# EAGLE design Tastatur_102 EAGLE 630 (EAGLE 6.3)

## Sheet 1 of 2
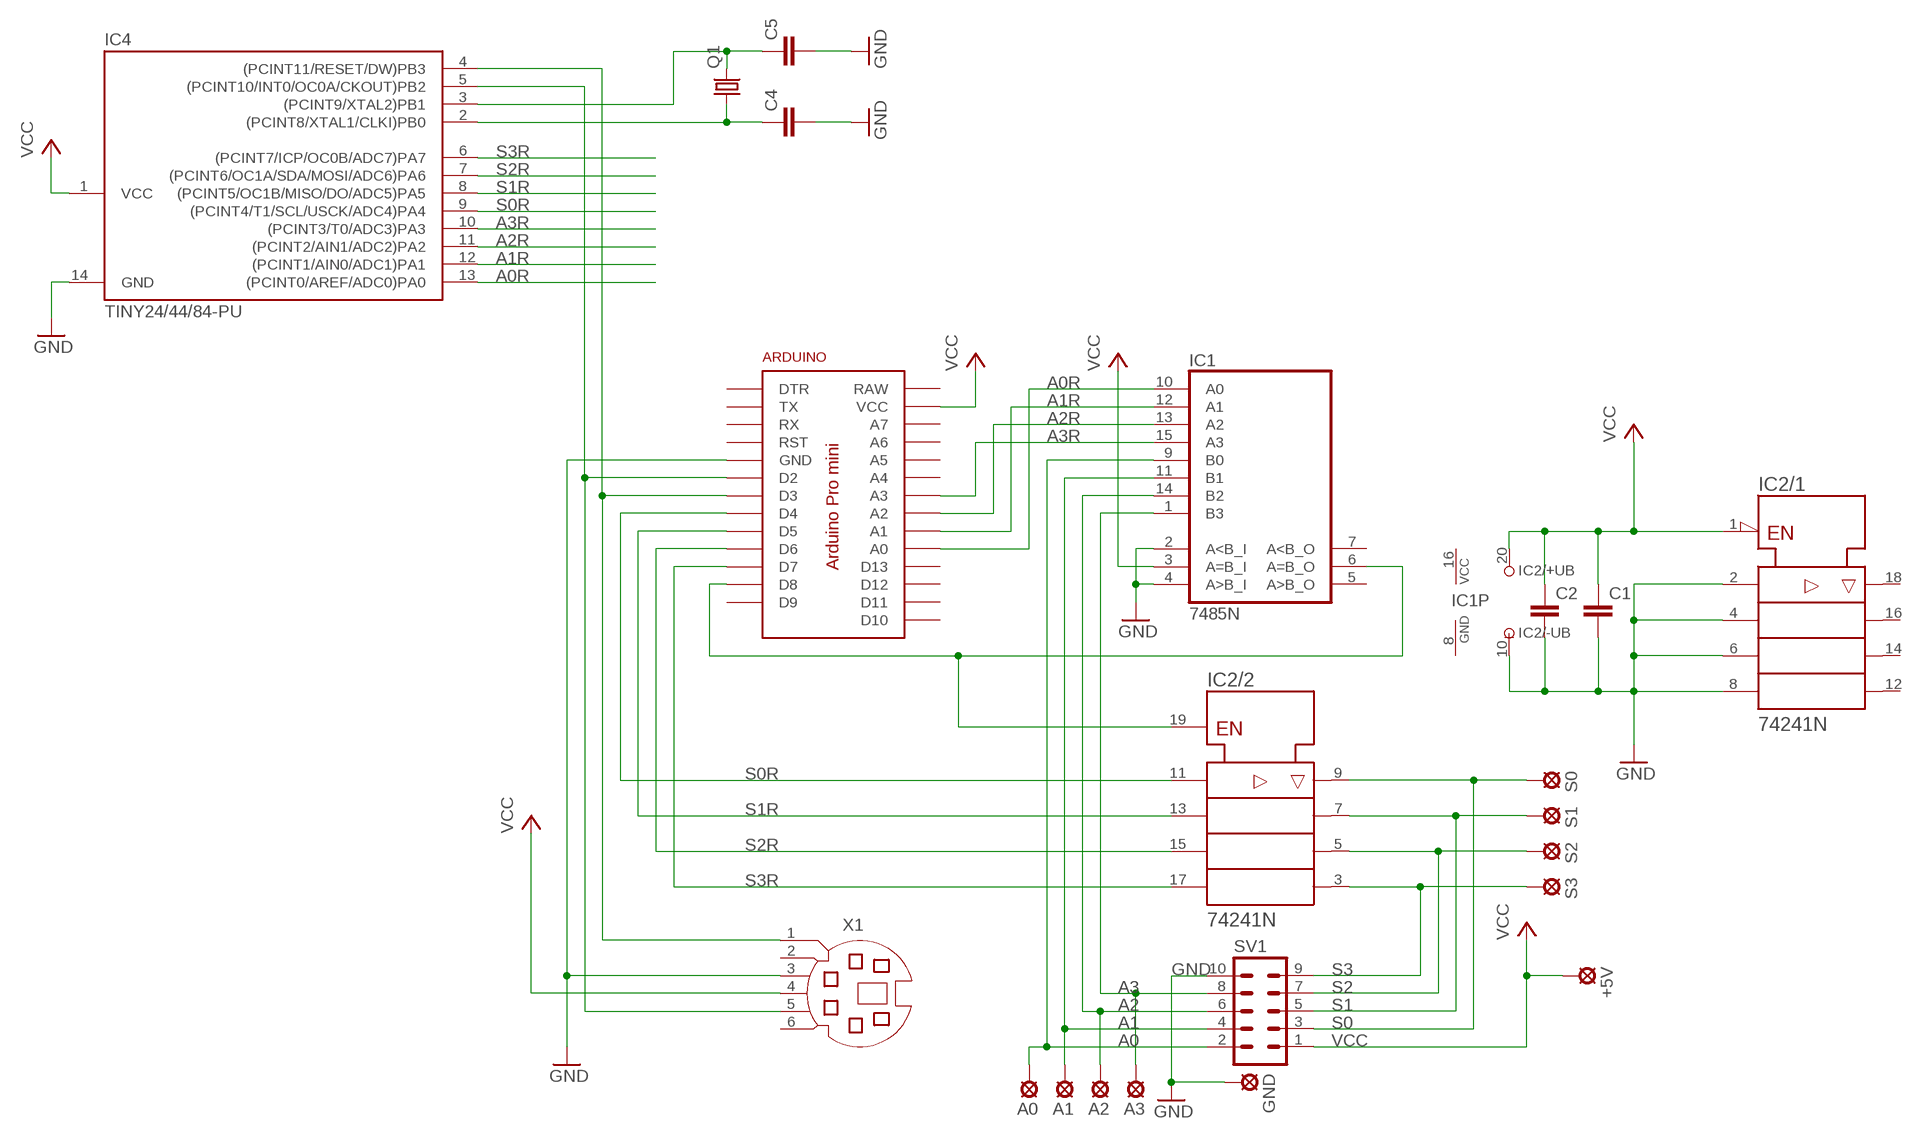
[diagram p0: schematic, sheet 1]

### Parts
+5V  MCS10B  [MCS10B]
A0  MCS10B  [MCS10B]
A1  MCS10B  [MCS10B]
A2  MCS10B  [MCS10B]
A3  MCS10B  [MCS10B]
ARDUINO  ARDUINO_PRO_MINIARDUINO_PRO_MINI_8  [ARDUINO_PRO_MINI_8]
C1  C-EU025-024X044  [C025-024X044]
C2  C-EU025-024X044  [C025-024X044]
C4  C-EU025-024X044  [C025-024X044]
C5  C-EU025-024X044  [C025-024X044]
GND  MCS10B  [MCS10B]
IC1  7485N  [DIL16]
IC2  74241N  [DIL20]
IC4  TINY24/44/84-PU  [DIL14]
Q1  CRYSTALHC49U-V  [HC49U-V]
S0  MCS10B  [MCS10B]
S1  MCS10B  [MCS10B]
S2  MCS10B  [MCS10B]
S3  MCS10B  [MCS10B]
SV1  ML10  [ML10]
X1  MD06SSMDIN06L  [MDIN06SSL]

### Nets
A0: A0.MP IC1.9(B0) SV1.2 ; also sheet 2
A0R: ARDUINO.A0 IC1.10(A0) IC4.13((PCINT0/AREF/ADC0)PA0)
A1: A1.MP IC1.11(B1) SV1.4 ; also sheet 2
A1R: ARDUINO.A1 IC1.12(A1) IC4.12((PCINT1/AIN0/ADC1)PA1)
A2: A2.MP IC1.14(B2) SV1.6 ; also sheet 2
A2R: ARDUINO.A2 IC1.13(A2) IC4.11((PCINT2/AIN1/ADC2)PA2)
A3: A3.MP IC1.1(B3) SV1.8 ; also sheet 2
A3R: ARDUINO.A3 IC1.15(A3) IC4.10((PCINT3/T0/ADC3)PA3)
GND: ARDUINO.GND ARDUINO.GND@1(GND) C1.2 C2.2 C4.2 C5.2 GND.MP IC1.2(A<B_I) IC1.4(A>B_I) IC2.2(/1:A1) IC2.4(/1:A2) IC2.6(/1:A3) IC2.8(/1:A4) IC2.10(/-UB:-UB) IC4.14(GND) SV1.10 X1.3 ; also sheet 2
N$1: ARDUINO.D2 IC4.5((PCINT10/INT0/OC0A/CKOUT)PB2) X1.5
N$2: ARDUINO.D3 IC4.4((PCINT11/RESET/DW)PB3) X1.1
N$3: C4.1 IC4.2((PCINT8/XTAL1/CLKI)PB0) Q1.1
N$4: C5.1 IC4.3((PCINT9/XTAL2)PB1) Q1.2
N$26: ARDUINO.D8 IC1.6(A=B_O) IC2.19(/2:G)
S0: IC2.9(/2:Y1) S0.MP SV1.3 ; also sheet 2
S0R: ARDUINO.D4 IC2.11(/2:A1) IC4.9((PCINT4/T1/SCL/USCK/ADC4)PA4)
S1: IC2.7(/2:Y2) S1.MP SV1.5 ; also sheet 2
S1R: ARDUINO.D5 IC2.13(/2:A2) IC4.8((PCINT5/OC1B/MISO/DO/ADC5)PA5)
S2: IC2.5(/2:Y3) S2.MP SV1.7 ; also sheet 2
S2R: ARDUINO.D6 IC2.15(/2:A3) IC4.7((PCINT6/OC1A/SDA/MOSI/ADC6)PA6)
S3: IC2.3(/2:Y4) S3.MP SV1.9 ; also sheet 2
S3R: ARDUINO.D7 IC2.17(/2:A4) IC4.6((PCINT7/ICP/OC0B/ADC7)PA7)
VCC: +5V.MP ARDUINO.VCC C1.1 C2.1 IC1.3(A=B_I) IC2.1(/1:!G) IC2.20(/+UB:+UB) IC4.1(VCC) SV1.1 X1.4 ; also sheet 2
Unconnected: ARDUINO.A4 ARDUINO.A5 ARDUINO.A6 ARDUINO.A7 ARDUINO.D9 ARDUINO.D10 ARDUINO.D11 ARDUINO.D12 ARDUINO.D13 ARDUINO.DTR ARDUINO.RAW ARDUINO.RST ARDUINO.RST@1(RST) ARDUINO.RX ARDUINO.TX IC1.5(A>B_O) IC1.7(A<B_O) IC2.12(/1:Y4) IC2.14(/1:Y3) IC2.16(/1:Y2) IC2.18(/1:Y1) X1.2 X1.6

## Sheet 2 of 2
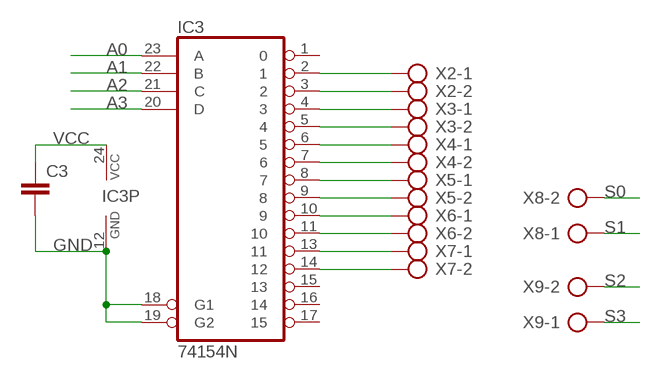
[diagram p1: schematic, sheet 2]

### Parts
C3  C-EU025-024X044  [C025-024X044]
IC3  74154N  [DIL24-6]
X2  AK500/2  [AK500/2]
X3  AK500/2  [AK500/2]
X4  AK500/2  [AK500/2]
X5  AK500/2  [AK500/2]
X6  AK500/2  [AK500/2]
X7  AK500/2  [AK500/2]
X8  AK500/2  [AK500/2]
X9  AK500/2  [AK500/2]

### Nets
A0: IC3.23(A) ; also sheet 1
A1: IC3.22(B) ; also sheet 1
A2: IC3.21(C) ; also sheet 1
A3: IC3.20(D) ; also sheet 1
GND: C3.2 IC3.12(GND) IC3.18(G1) IC3.19(G2) ; also sheet 1
N$6: IC3.2 X2.1
N$11: IC3.3 X2.2
N$13: IC3.4 X3.1
N$15: IC3.5 X3.2
N$17: IC3.6 X4.1
N$27: IC3.7 X4.2
N$30: IC3.8 X5.1
N$35: IC3.9 X5.2
N$37: IC3.10 X6.1
N$38: IC3.11 X6.2
N$39: IC3.13 X7.1
N$40: IC3.14 X7.2
S0: X8.2 ; also sheet 1
S1: X8.1 ; also sheet 1
S2: X9.2 ; also sheet 1
S3: X9.1 ; also sheet 1
VCC: C3.1 IC3.24(VCC) ; also sheet 1
Unconnected: IC3.1 IC3.15 IC3.16 IC3.17

## Power pins joined to a net without a drawn wire
GND: IC1.8(GND)
VCC: IC1.16(VCC)

## Library data of the parts
+5V A0 A1-A3 GND S0 S1-S3 = solpad:MCS10B: SOLDER PAD MC S1, distributor Buerklin, 15F505
ARDUINO = arduinopromini:ARDUINO_PRO_MINI: For creating Arduino Pro Mini shields
C1-C5 = rcl:C-EU: CAPACITOR, European symbol
IC1 = 74xx-eu:74*85: 4-bit magnitude COMPARATOR
IC2 = 74ttl-din:74*241: Octal BUFFER and LINE DRIVER, 3-state
IC3 = 74xx-eu:74*154: 4-line to 16-line data SELECTOR/MULTIPLEXER
IC4 = avr-6:TINY24/44/84
Q1 = adafruit:CRYSTAL: CRYSTAL; OC_FARNELL: 1666969; OC_NEWARK: unknown
SV1 = con-ml:ML10: HARTING; OC_FARNELL: unknown; OC_NEWARK: unknown
X1 = con-yamaichi:MD06SS: YAMAICHI CONNECTOR
X2-X9 = con-ptr500:AK500/2: CONNECTOR; OC_FARNELL: unknown; OC_NEWARK: unknown

## Board
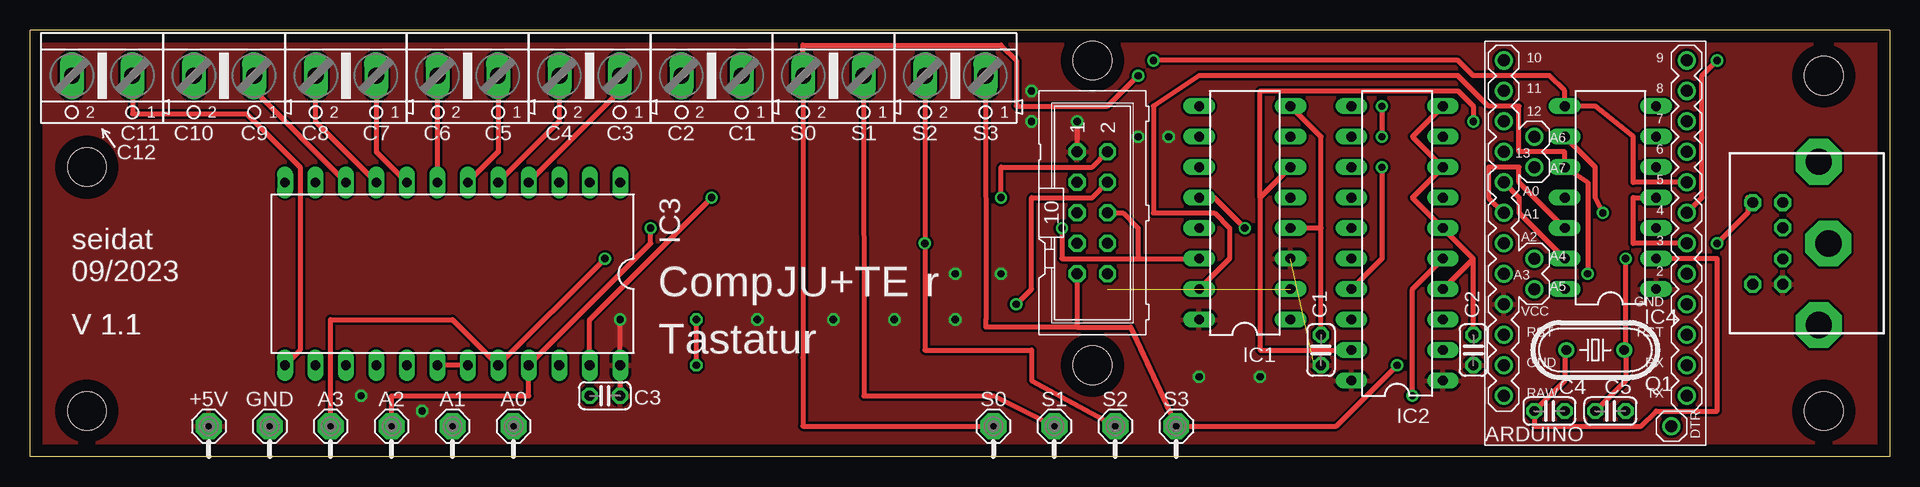
[diagram p2: board, top side]
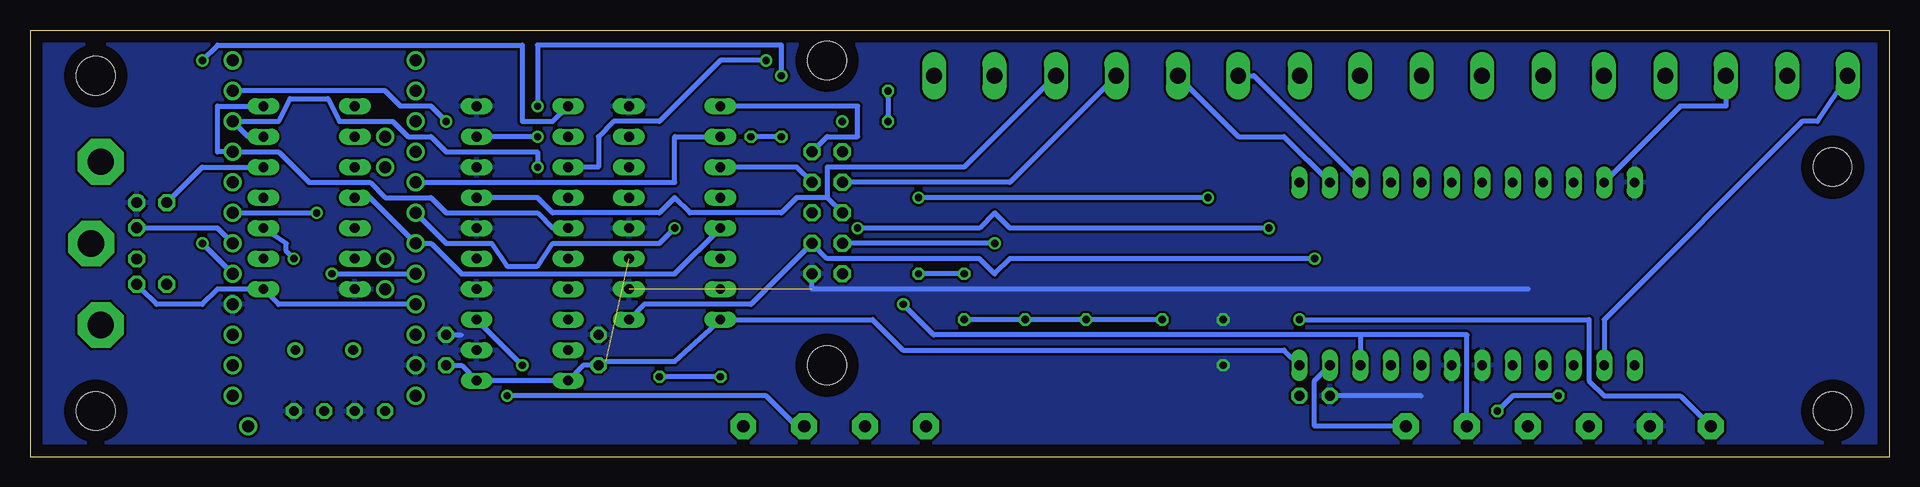
[diagram p3: board, bottom side, seen from below]

Size 155 x 35.56 mm. Coordinates in mm from the lower left corner, seen from the top.
Outline: 155,35.56 0,35.56 0,0 155,0 155,35.56
Copper layers (1*16): Top 0.035mm / dielectric 1.5mm / Bottom 0.035mm
Design rules "default *": minimum track width 16mil, minimum drill 24mil, track to track 8mil, track to pad 8mil, pad to pad 8mil, via to via 8mil, smd to smd 8mil, copper to edge 40mil, drill to drill 8mil, minimum pad ring 10mil, minimum via ring 8mil, stop-mask expansion 4mil, vias tented up to drill 0mil, thermal gap 10mil
Holes 3.2 mm at 149.52,3.81 149.52,31.75 88.56,7.62 88.56,33.02 4.74,24.13 4.74,3.81

### Footprints (pad centres in the part's own frame; a part is rotated, then mirrored left to right if it is on the bottom)
MCS10B = drill 1.016 pad 2.159 octagon: MP 0,0
ARDUINO_PRO_MINI_8 = drill 1: A0 7.62,-7.62; A1 7.62,-5.08; A2 7.62,-2.54; A3 7.62,0; A4 5.08,-1.27; A5 5.08,1.27; A6 5.08,-11.43; A7 5.08,-8.89; D2 -7.62,0; D3 -7.62,-2.54; D4 -7.62,-5.08; D5 -7.62,-7.62; D6 -7.62,-10.16; D7 -7.62,-12.7; D8 -7.62,-15.24; D9 -7.62,-17.78; D10 7.62,-17.78; D11 7.62,-15.24; D12 7.62,-12.7; D13 7.62,-10.16; DTR -6.35,12.7; GND -7.62,2.54; GND@1 7.62,7.62; RAW 7.62,10.16; RST 7.62,5.08; RST@1 -7.62,5.08; RX -7.62,7.62; TX -7.62,10.16; VCC 7.62,2.54
C025-024X044 = drill 0.813 octagon: 1 -1.27,0; 2 1.27,0
DIL16 = drill 0.813 long: 1 -8.89,-3.81; 2 -6.35,-3.81; 3 -3.81,-3.81; 4 -1.27,-3.81; 5 1.27,-3.81; 6 3.81,-3.81; 7 6.35,-3.81; 8 8.89,-3.81; 9 8.89,3.81; 10 6.35,3.81; 11 3.81,3.81; 12 1.27,3.81; 13 -1.27,3.81; 14 -3.81,3.81; 15 -6.35,3.81; 16 -8.89,3.81
DIL20 = drill 0.813 long: 1 -11.43,-3.81; 2 -8.89,-3.81; 3 -6.35,-3.81; 4 -3.81,-3.81; 5 -1.27,-3.81; 6 1.27,-3.81; 7 3.81,-3.81; 8 6.35,-3.81; 9 8.89,-3.81; 10 11.43,-3.81; 11 11.43,3.81; 12 8.89,3.81; 13 6.35,3.81; 14 3.81,3.81; 15 1.27,3.81; 16 -1.27,3.81; 17 -3.81,3.81; 18 -6.35,3.81; 19 -8.89,3.81; 20 -11.43,3.81
DIL24-6 = drill 0.813 long: 1 -13.97,-7.62; 2 -11.43,-7.62; 3 -8.89,-7.62; 4 -6.35,-7.62; 5 -3.81,-7.62; 6 -1.27,-7.62; 7 1.27,-7.62; 8 3.81,-7.62; 9 6.35,-7.62; 10 8.89,-7.62; 11 11.43,-7.62; 12 13.97,-7.62; 13 13.97,7.62; 14 11.43,7.62; 15 8.89,7.62; 16 6.35,7.62; 17 3.81,7.62; 18 1.27,7.62; 19 -1.27,7.62; 20 -3.81,7.62; 21 -6.35,7.62; 22 -8.89,7.62; 23 -11.43,7.62; 24 -13.97,7.62
DIL14 = drill 0.813 long: 1 -7.62,-3.81; 2 -5.08,-3.81; 3 -2.54,-3.81; 4 0,-3.81; 5 2.54,-3.81; 6 5.08,-3.81; 7 7.62,-3.81; 8 7.62,3.81; 9 5.08,3.81; 10 2.54,3.81; 11 0,3.81; 12 -2.54,3.81; 13 -5.08,3.81; 14 -7.62,3.81
HC49U-V = drill 0.813: 1 -2.413,0; 2 2.413,0
ML10 = drill 0.914 octagon: 1 -5.08,-1.27; 2 -5.08,1.27; 3 -2.54,-1.27; 4 -2.54,1.27; 5 0,-1.27; 6 0,1.27; 7 2.54,-1.27; 8 2.54,1.27; 9 5.08,-1.27; 10 5.08,1.27
MDIN06SSL = drill 0.9 octagon: 1 1.3,8.5; 2 -1.3,8.5; 3 3.4,8.5; 4 -3.4,8.5; 5 3.4,11; 6 -3.4,11 | drill 2.2 pad 3.81 octagon: P$1 -6.8,5.5; P$2 0,4.7; P$3 6.8,5.5
AK500/2 = drill 1.321 long: 1 -2.515,0; 2 2.515,0

### Placement (x,y rotation side)
+5V  14.9,2.54 0 top
A0  40.3,2.54 0 top
A1  35.22,2.54 0 top
A2  30.14,2.54 0 top
A3  25.06,2.54 0 top
ARDUINO  130.47,15.24 180 top
C1  107.61,8.89 90 top
C2  120.31,8.89 90 top
C3  47.92,5.08 180 top
C4  126.66,3.81 0 top
C5  131.74,3.81 0 top
GND  19.98,2.54 0 top
IC1  101.26,20.32 90 top
IC2  113.96,17.78 90 top
IC3  35.22,15.24 180 top
IC4  131.74,21.59 90 top
Q1  130.47,8.89 0 top
S0  80.3,2.54 0 top
S1  85.38,2.54 0 top
S2  90.46,2.54 0 top
S3  95.55,2.54 0 top
SV1  88.56,20.32 270 top
X1  154.6,17.78 90 top
X2  56.81,31.75 180 top
X3  46.65,31.75 180 top
X4  36.49,31.75 180 top
X5  26.33,31.75 180 top
X6  16.17,31.75 180 top
X7  6.01,31.75 180 top
X8  66.97,31.75 180 top
X9  77.13,31.75 180 top

### Tracks (layer width: path | path; a pad name or v marks a point on that pad's centre or on a via)
A0  (via drill 0.61)
  Top 0.406: SV1.2 88.56,24.13 80.94,24.13 v80.94,21.59 | v56.81,21.59 46.65,11.43 IC3.23
  Bottom 0.406: IC1.9 86.02,29.21 86.02,26.67 88.56,26.67 SV1.2 | IC3.23 47.92,6.35 47.92,2.54 A0.MP | v56.81,21.59 v80.94,21.59
A0R
  Top 0.406: IC4.13 124.12,20.32 124.12,21.59 ARDUINO.A0
  Bottom 0.406: IC1.10 101.26,26.67 101.26,22.86 ARDUINO.A0
A1  (via drill 0.61)
  Top 0.406: SV1.4 88.56,21.59 83.48,21.59 83.48,13.97 v82.21,12.7
  Bottom 0.406: IC1.11 91.1,24.13 SV1.4 | 44.11,10.16 IC3.22 | 44.11,10.16 35.22,10.16 A1.MP | v82.21,12.7 79.67,10.16 44.11,10.16
A1R  (via drill 0.61)
  Top 0.406: ARDUINO.A1 121.58,21.59 121.58,24.13 124.12,24.13 124.12,22.86 IC4.12 | IC1.12 98.72,21.59 v101.26,19.05
  Bottom 0.406: v101.26,19.05 102.53,17.78 111.42,17.78 112.69,15.88 115.23,15.88 116.5,17.78 120.31,17.78 ARDUINO.A1
A2  (via drill 0.61)
  Top 0.406: 92.37,16.51 IC1.14 | 92.37,16.51 92.37,19.05 91.1,20.32 SV1.6 | A2.MP 30.14,5.08 41.57,5.08 IC3.21 51.73,17.78 v51.73,19.05 | 92.37,16.51 86.02,16.51 v86.02,19.05
  Bottom 0.406: v51.73,19.05 73.32,19.05 74.59,20.32 75.86,19.05 v86.02,19.05
A2R
  Bottom 0.406: IC1.13 101.26,15.24 119.04,15.24 121.58,17.78 ARDUINO.A2 126.66,21.59 IC4.11
A3  (via drill 0.61)
  Top 0.406: A3.MP 25.06,11.43 35.22,11.43 IC3.20 v47.92,16.51
  Bottom 0.406: IC1.1 103.8,12.7 94.91,12.7 SV1.8 88.56,16.51 75.86,16.51 74.59,15.24 73.32,16.51 v47.92,16.51
A3R  (via drill 0.61)
  Top 0.406: IC1.15 99.99,16.51 99.99,19.05 98.72,20.32 93.64,20.32 93.64,29.21 97.45,31.75 119.04,31.75 121.58,29.21 124.12,29.21 124.12,25.4 127.93,25.4 IC4.10 129.84,22.86 v129.84,15.24
  Bottom 0.406: v129.84,15.24 ARDUINO.A3
GND  (via drill 0.61)  (1 unrouted)
  Top 0.406: IC3.19 IC3.18 | 107.61,19.05 IC1.4 | C1.2 107.61,19.05 | IC1.8 107.61,26.67 107.61,19.05 | IC2.10 115.23,26.67 IC2.8 115.23,21.59 IC2.6 120.31,16.51 | 120.31,16.51 IC2.4 | C2.2 120.31,16.51 | v55.54,11.43 v55.54,7.62
  Bottom 0.406: 39.03,5.08 C3.2 | SV1.10 89.83,13.97 30.14,13.97 | 145.71,21.59 X1.3 | C2.2 119.04,10.16
  pour Bottom: -1.61,41.91 64.43,41.91 64.43,40.64 155.87,41.91 155.87,-6.35 -1.61,-6.35
N$1  (via drill 0.61)
  Top 0.406: v140.63,17.78 143.17,20.32 143.17,21.59 X1.5
  Bottom 0.406: IC4.5 140.63,24.13 143.17,21.59 X1.5 | v140.63,17.78 ARDUINO.D2
N$2
  Top 0.406: IC4.4 133.65,21.59 133.65,17.78 ARDUINO.D3
  Bottom 0.406: ARDUINO.D3 139.36,19.05 145.71,19.05 X1.1
N$3
  Top 0.406: Q1.1 127.93,8.89 127.93,6.35 C4.1 125.39,2.54 134.28,2.54 135.55,3.81 140.63,3.81 140.63,16.51 IC4.2
N$4  (via drill 0.61)
  Top 0.406: C5.1 133.01,6.35 133.01,8.89 | 133.01,8.89 v133.01,16.51 | 133.01,8.89 Q1.2
  Bottom 0.406: v133.01,16.51 133.65,17.14 133.65,17.78 IC4.3
N$6
  Bottom 0.406: IC3.2 50.46,26.67 54.27,26.67 59.35,31.75 X2.1
N$11
  Bottom 0.406: IC3.3 53,31.75 X2.2
N$13
  Top 0.406: IC3.4 49.19,30.48 49.19,31.75 X3.1
N$15
  Top 0.406: IC3.5 44.11,27.94 44.11,31.75 X3.2
N$17
  Top 0.406: IC3.6 39.03,25.4 39.03,31.75 X4.1
N$26  (via drill 0.61)
  Top 0.406: IC2.19 102.53,8.89 102.53,21.59 | IC1.6 102.53,21.59 | v120.31,27.94 120.31,29.21 119.04,30.48 102.53,30.48 102.53,21.59
  Bottom 0.406: ARDUINO.D8 125.39,30.48 124.12,29.21 121.58,29.21 v120.31,27.94
N$27
  Top 0.406: IC3.7 33.95,31.75 X4.2
N$30
  Top 0.406: IC3.8 28.87,25.4 28.87,31.75 X5.1
N$35
  Top 0.406: IC3.9 23.79,27.94 23.79,31.75 X5.2
N$37
  Top 0.406: IC3.10 18.71,30.48 18.71,31.75 X6.1
N$38
  Bottom 0.406: IC3.11 17.44,29.21 13.63,29.21 X6.2 13.63,31.75
N$39
  Top 0.406: IC3.13 22.52,8.89 22.52,24.13 18.08,28.57 8.55,28.57 8.55,31.75 X7.1
N$40
  Bottom 0.406: IC3.14 23.79,11.43 7.28,27.94 6.01,27.94 3.47,31.75 X7.2
S0  (via drill 0.61)
  Top 0.406: S0.MP 64.43,2.54 64.43,8.26 X8.2 64.43,31.75 64.43,34.29 80.94,34.29 82.21,33.02 82.21,29.21 89.83,29.21 v92.37,31.75 | v112.69,29.21 v112.69,26.67
  Bottom 0.406: SV1.3 73.32,22.86 64.43,31.75 X8.2 | v112.69,26.67 IC2.9 | v112.69,29.21 112.69,34.29 92.37,34.29 v92.37,31.75
S0R  (via drill 0.61)
  Top 0.406: v140.63,33.02 139.36,31.75 139.36,21.59 ARDUINO.D4 | IC4.9 130.47,24.13 130.47,21.59 v131.1,20.32
  Bottom 0.406: IC2.11 111.42,27.94 113.96,27.94 113.96,34.29 139.36,34.29 v140.63,33.02 | ARDUINO.D4 v131.1,20.32
S1
  Top 0.406: X8.1 69.51,5.08 80.3,5.08 S1.MP
  Bottom 0.406: IC2.7 112.69,21.59 111.42,20.32 102.53,20.32 101.26,21.59 99.99,20.32 92.37,20.32 91.1,21.59 88.56,21.59 | SV1.5 88.56,21.59 | 88.56,21.59 88.56,24.13 77.13,24.13 69.51,31.75 X8.1
S1R  (via drill 0.61)
  Top 0.406: ARDUINO.D5 133.65,22.86 133.65,26.67 130.47,29.21 IC4.8 127.93,30.48 126.66,31.75 120.31,31.75 119.04,33.02 v93.64,33.02
  Bottom 0.406: IC2.13 107.61,24.13 107.61,26.67 106.34,27.94 102.53,27.94 97.45,33.02 v93.64,33.02
S2  (via drill 0.61)
  Top 0.406: X9.2 v74.6,17.78 | v74.6,17.78 74.59,8.89 83.48,8.89 83.48,6.35 S2.MP | v74.59,17.78 v74.6,17.78 | IC2.5 115.23,13.97 v115.23,5.08
  Bottom 0.406: v74.59,17.78 SV1.7 | v115.23,5.08 93.64,5.08 91.1,2.54 S2.MP
S2R
  Bottom 0.406: IC4.7 139.36,29.21 139.36,25.4 ARDUINO.D6 134.28,25.4 131.74,22.86 126.66,22.86 125.39,21.59 121.58,21.59 120.31,20.32 112.69,20.32 111.42,19.05 IC2.15
S3  (via drill 0.61)
  Top 0.406: X9.1 79.67,11.43 79.67,10.79 87.29,10.79 | 87.29,10.79 91.73,10.79 S3.MP 108.88,2.54 v113.96,7.62 | SV1.9 87.29,10.79
  Bottom 0.406: v113.96,7.62 IC2.3
S3R  (via drill 0.61)
  Top 0.406: IC2.17 112.69,16.51 v112.69,24.13
  Bottom 0.406: IC4.6 136.82,26.67 ARDUINO.D7 134.28,27.94 133.33,29.84 130.15,29.84 129.2,27.94 124.75,27.94 123.48,26.67 121.58,26.67 120.31,25.4 112.69,25.4 v112.69,24.13
VCC  (via drill 0.61)  (1 unrouted)
  Top 0.406: C3.1 IC3.24 v49.19,11.43 | v87.29,27.94 SV1.1
  Bottom 0.406: IC3.24 50.46,8.89 82.21,8.89 84.75,11.43 IC1.16 101.26,7.94 106.97,7.94 C1.1 108.88,7.62 IC2.20 IC2.1 119.04,7.62 C2.1 | +5V.MP 17.44,5.08 23.79,5.08 25.06,6.35 25.06,11.43 v49.19,11.43 | ARDUINO.VCC 134.28,12.7 IC4.1 139.36,13.97 140.63,12.7 144.44,12.7 145.71,13.97 X1.4 | v60.62,11.43 v66.97,11.43 v72.05,11.43 v77.13,11.43 | v97.45,6.67 v102.53,6.67 | v77.13,15.24 v80.94,15.24 | v83.48,30.48 v83.48,27.94 | v27.6,5.08 31.41,5.08 v32.68,3.81 | v92.37,26.67 v94.91,26.67
  pour Top: -1.61,38.1 60.62,38.1 60.62,36.83 157.14,39.37 157.14,-5.08 -1.61,-5.08

### Text on the board
tPlace: C11 | C10 | C9 | C8 | C7 | C6 | C5 | C4 | C3 | C2 | C1 | S0 | S1 | S2 | S3 | C12 | Comp | JU+TE | r | V 1.1 | V 1.1
tNames: seidat / 09/2023 | Tastatur